# Altium schematic sheet BattPower.SchDoc
size A4
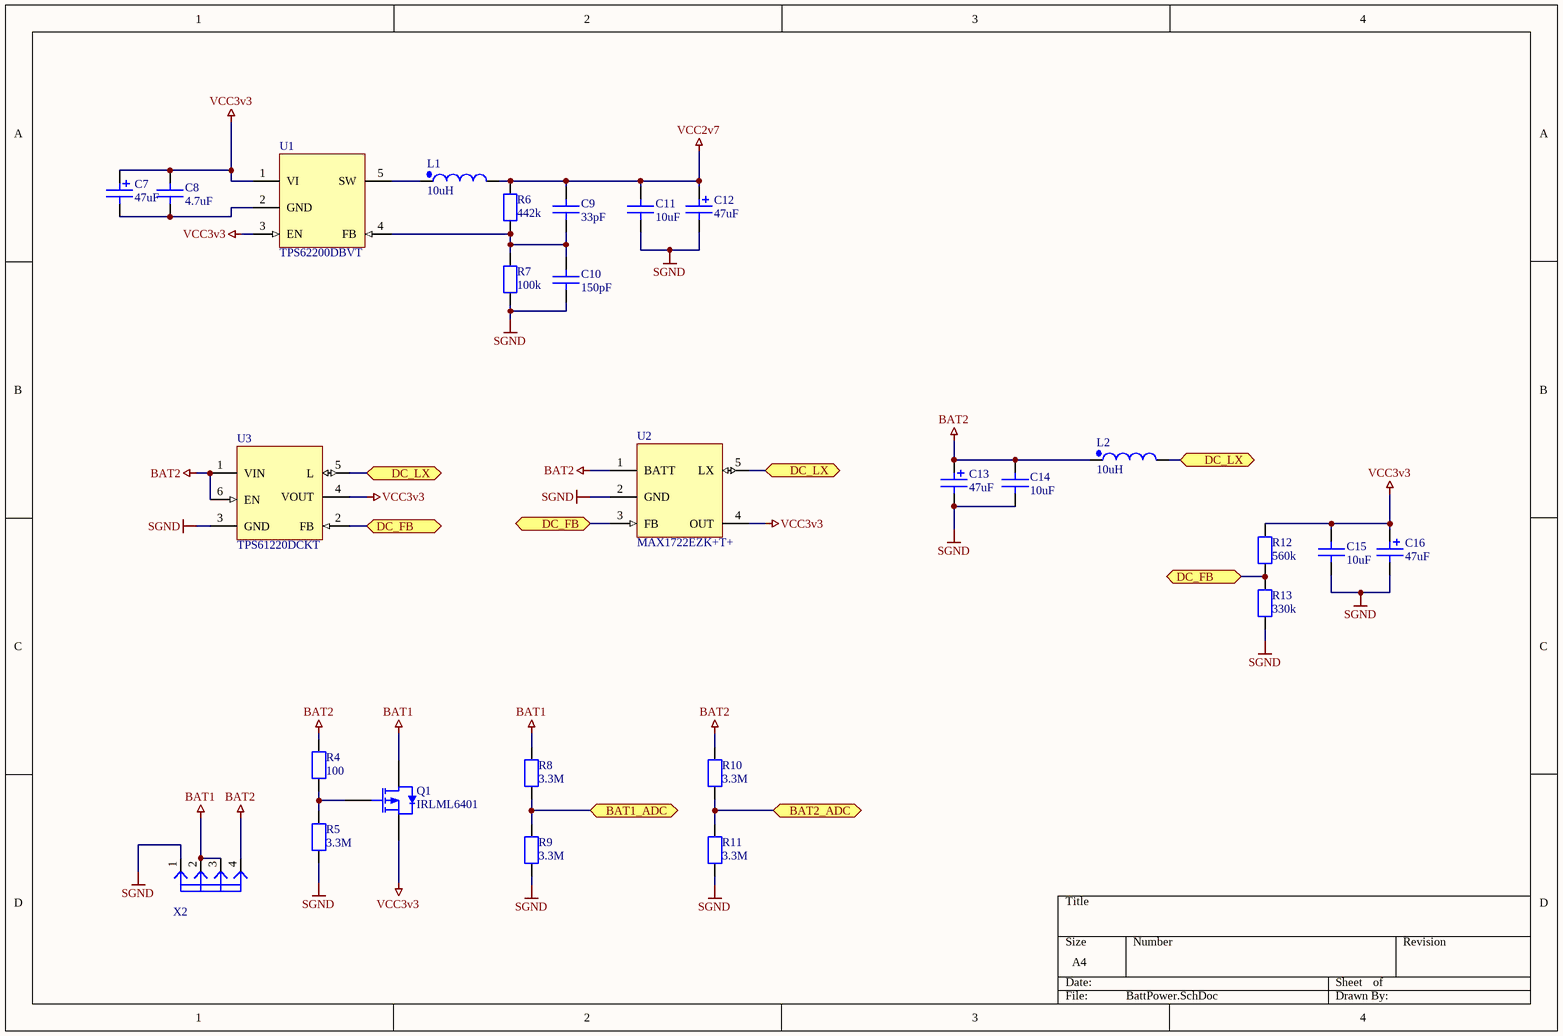
[diagram p0: BattPower.SchDoc]

## Parts
C7  value 47uF  [TC2917]  (hidden comment: C47uF-10V-tant)
C8  value 4.7uF  [C0805]  (hidden comment: C4.7uF-16V)
C9  value 33pF  [C0805]  (hidden comment: C33pF-50V)
C10  value 150pF  [C0805]  (hidden comment: C150pF-50V)
C11  value 10uF  [C0805]  (hidden comment: C10uF-16V)
C12  value 47uF  [TC2917]  (hidden comment: C47uF-10V-tant)
C13  value 47uF  [TC2917]  (hidden comment: C47uF-10V-tant)
C14  value 10uF  [C0805]  (hidden comment: C10uF-16V)
C15  value 10uF  [C0805]  (hidden comment: C10uF-16V)
C16  value 47uF  [TC2917]  (hidden comment: C47uF-10V-tant)
L1  value 10uH  [CD54-CDRH4D]  (hidden comment: CD54)
L2  value 10uH  [CD54-CDRH4D]  (hidden comment: CD54)
Q1  IRLML6401  [SOT23_N]
R4  value 100  [R0805]  (hidden comment: R100-5%)
R5  value 3.3M  [R0805]  (hidden comment: R3.3M-5%)
R6  value 442k  [R0805]  (hidden comment: R442k-1%)
R7  value 100k  [R0805]  (hidden comment: R100k-1%)
R8  value 3.3M  [R0805]  (hidden comment: R3.3M-5%)
R9  value 3.3M  [R0805]  (hidden comment: R3.3M-5%)
R10  value 3.3M  [R0805]  (hidden comment: R3.3M-5%)
R11  value 3.3M  [R0805]  (hidden comment: R3.3M-5%)
R12  value 560k  [R0805]  (hidden comment: R560k-1%)
R13  value 330k  [R0805]  (hidden comment: R330k-1%)
U1  TPS62200DBVT  [5ST1_N]
U2  MAX1722EZK+T+  [5ST1_N]
U3  TPS61220DCKT  [SC70-6-N]
X2  PLS-4  [PLS-4]  (value not drawn)

## Ports
BAT1_ADC, BAT2_ADC, DC_FB, DC_LX

## Nets
BAT1: Q1.3(D) R8.2 X2.2 X2.3
BAT2: C13.1 C14.2 L2.1 R4.2 R10.2 U2.1(BATT) U3.1(VIN) U3.6(EN) X2.4
SGND: C10.1 C11.1 C12.2 C13.2 C14.1 C15.1 C16.2 R5.1 R7.1 R9.1 R11.1 R13.1 U2.2(GND) U3.3(GND) X2.1
VCC2v7: C9.2 C11.2 C12.1 L1.2 R6.2
VCC3v3: C7.1 C8.2 C15.2 C16.1 Q1.2(S) R12.2 U1.1(VI) U1.3(EN) U2.4(OUT) U3.4(VOUT)
BAT1_ADC: R8.1 R9.2 ; port BAT1_ADC
BAT2_ADC: R10.1 R11.2 ; port BAT2_ADC
DC_FB: R12.1 R13.2 U2.3(FB) U3.2(FB) ; port DC_FB
DC_LX: L2.2 U2.5(LX) U3.5(L) ; port DC_LX
NetC7_2: C7.2 C8.1 U1.2(GND)
NetC9_1: C9.1 C10.2 R6.1 R7.2 U1.4(FB)
NetL1_1: L1.1 U1.5(SW)
NetQ1_1: Q1.1(G) R4.1 R5.2

## Library data of the parts
C7 C12 C13 C16 = C47uF-10V-tant: Type: Конденсатор танталовый; Voltage: 10V; Name: C47uF-10V-tant
C8 = C4.7uF-16V: Type: Конденсатор керамический; Voltage: 16V; Name: C4.7uF-16V
C9 = C33pF-50V: Type: Конденсатор керамический; Voltage: 50V; Name: C33pF-50V
C10 = C150pF-50V: Type: Конденсатор керамический; Voltage: 50V; Name: C150pF-50V
C11 C14 C15 = C10uF-16V: Type: Конденсатор керамический; Voltage: 16V; Name: C10uF-16V
L1 L2 = CD54NP-100M: Inductor with Winding Polarity Marking; Current: 1.44A; Type: Дроссель; Name: CD54
Q1 = IRLML6401: P-Channel Power MOSFET; Type: MOSFET P-канал; Vds: 12V; Id: 4.3A; Vgs: 0.4-0.95V; Name: IRLML6401
R4 = R100-5%: R-100-5%; Precision: 5%; Type: Резистор; Name: R100-5%
R5 R8-R11 = R3.3M-5%: Precision: 5%; Type: Резистор; Name: R3.3M-5%
R6 = R442k-1%: Precision: 1%; Type: Резистор; Name: R442k-1%
R7 = R100k-1%: Precision: 1%; Type: Резистор; Name: R100k-1%
R12 = R560k-1%: Precision: 1%; Type: Резистор; Name: R560k-1%
R13 = R330k-1%: Precision: 1%; Type: Резистор; Name: R330k-1%
U1 = TPS62200DBVT: High efficiency step-down DC-DC convertor, 5-pin SOT23; Name: TPS62200DBVT; Type: DC-DC конвертор понижающий
U2 = MAX1722EZK+T+: High efficiency step-down DC-DC convertor, 5-pin SOT23; Name: MAX1722EZK+T+; Type: DC-DC конвертор повышающий
U3 = TPS61220DCKT: Low input voltage step-up DC-DC convertor, 6-pin SC70; Name: TPS61220DCKT; Type: DC-DC конвертор повышающий
X2 = PLS-4: Name: PLS-4; Type: Линейка